# Altium schematic sheet payload_esp32.SchDoc (part 3 of 4)
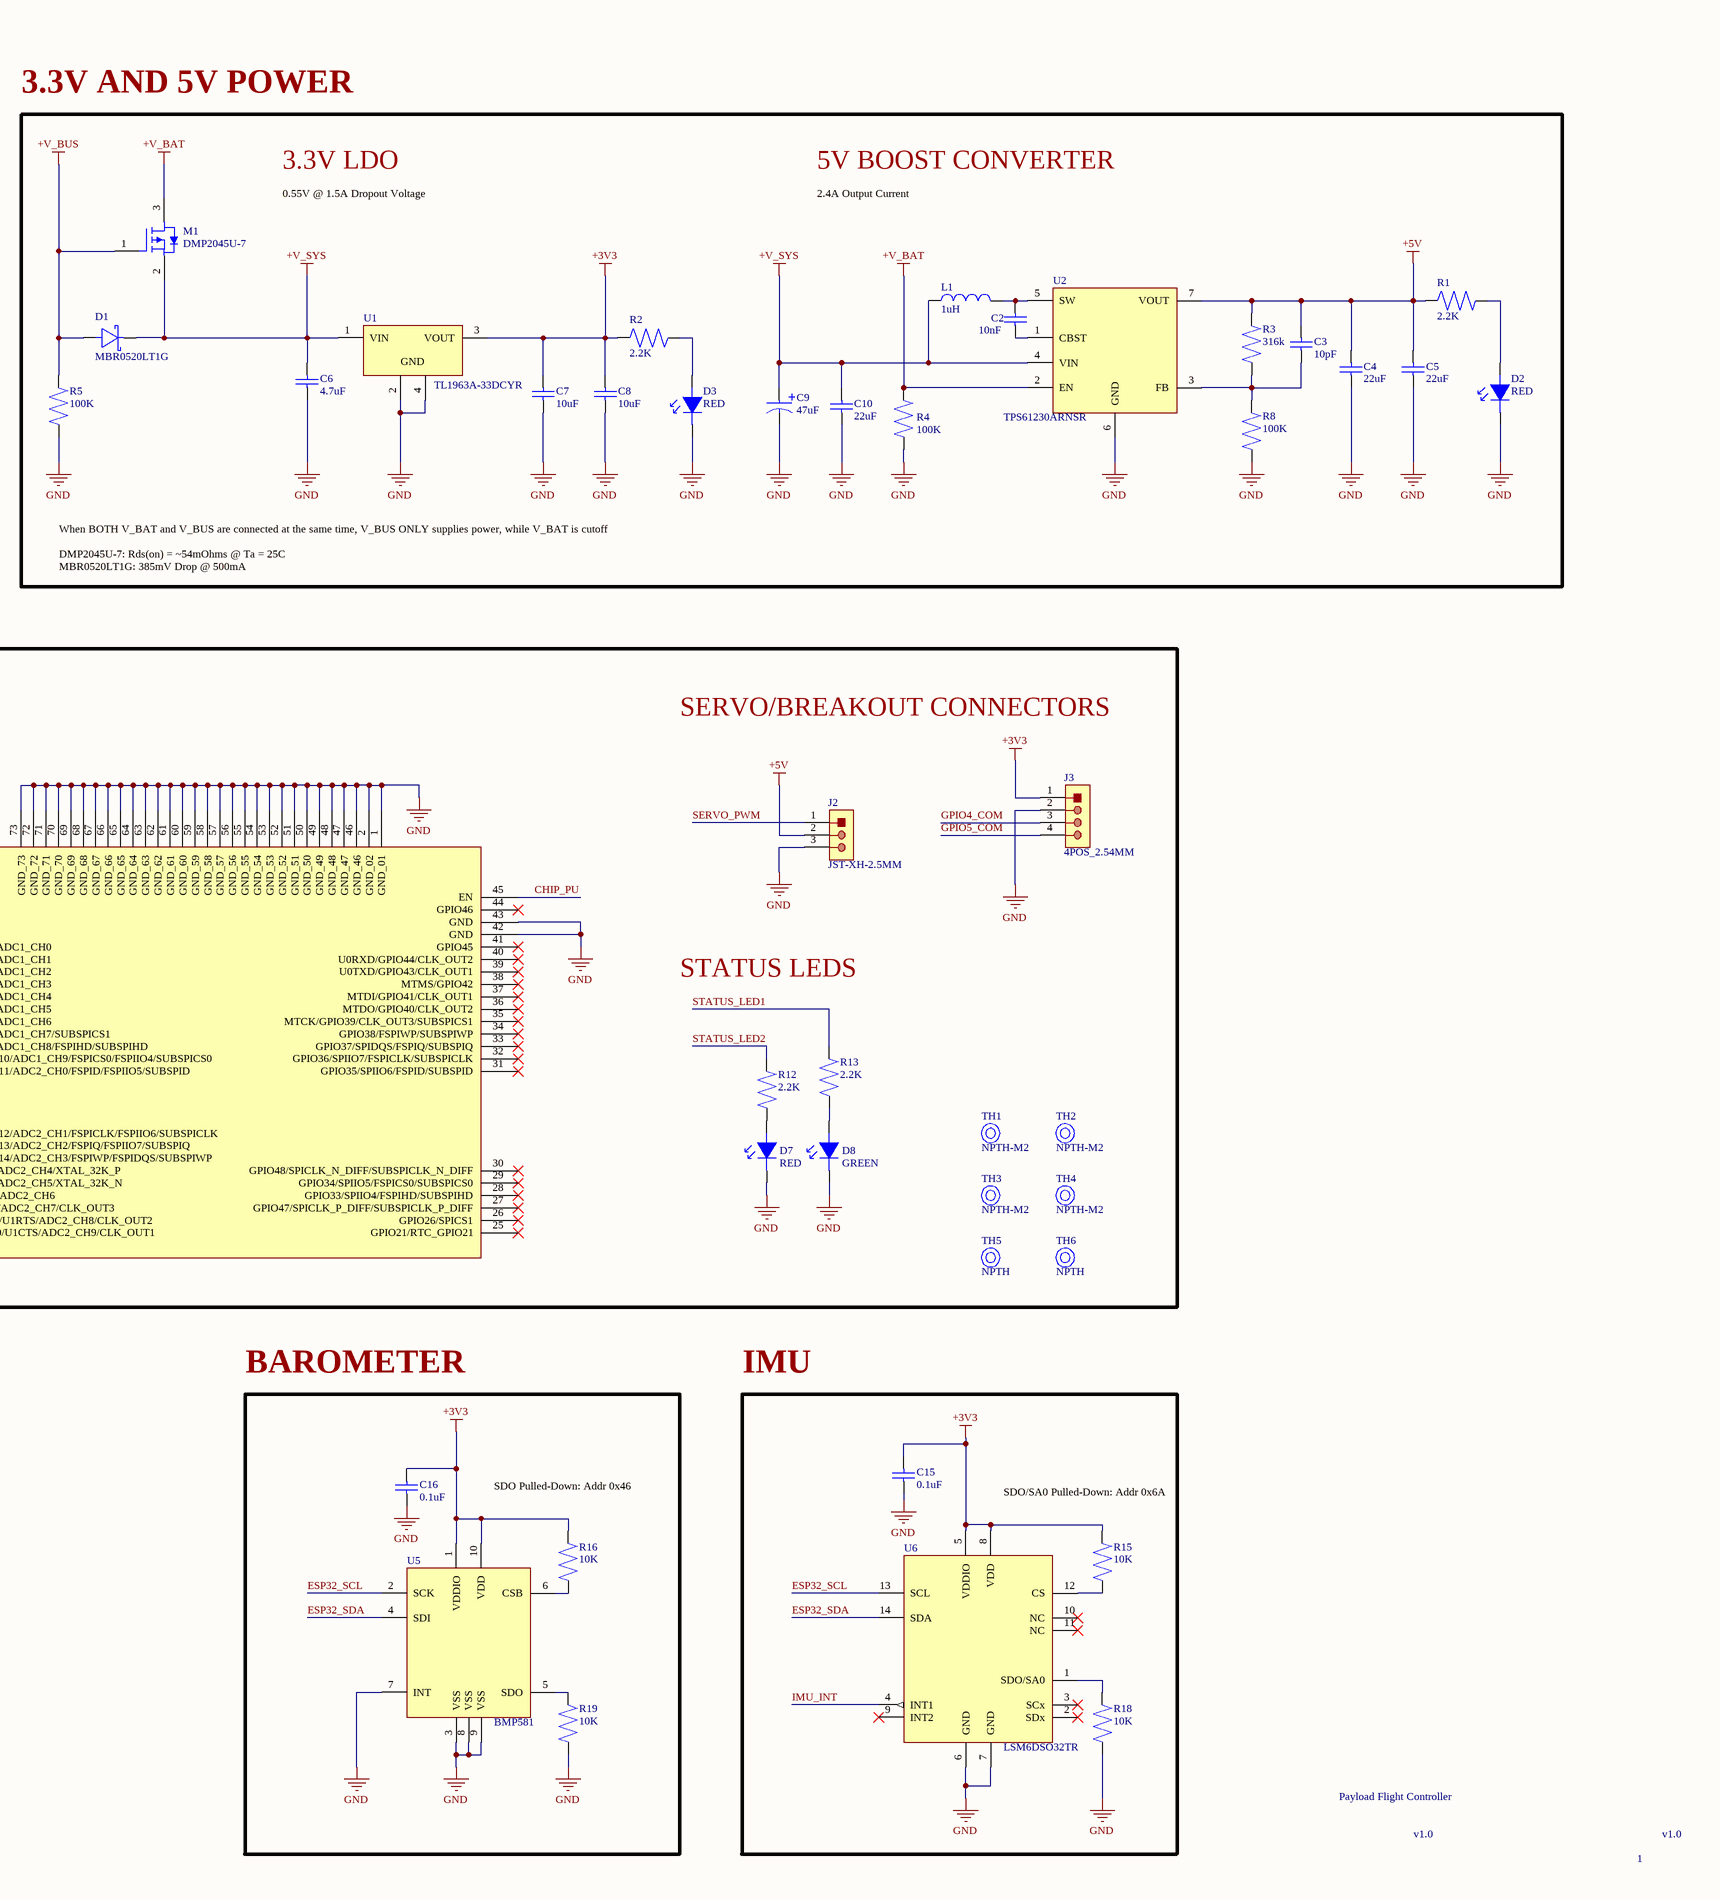
[diagram p3: payload_esp32.SchDoc, right]

## Library data of the parts (continued)
D2 D3 D7 = VLMS1500-GS08: LED RED 0402 SMD; Manufacturer: Vishay; Shape: Rectangular; Forward Current: 30mA; Forward Voltage: 2.4V; Luminous Intensity-Nom: 54mcd; Channels: 1; Optoelectronic Device Type: SINGLE COLOR LED; Reverse Voltage-Max: 5V; Viewing Angle: 130°; Overall Height: 0.35mm; Supplier: Digikey; Supplier Part Number: VLMS1500-GS08CT-ND; Manufacturer Part Number: VLMS1500-GS08; RoHS: Yes; Category: LEDs; Stock: 76559; Pricing: 1=0.24, 10=0.164, 100=0.1147, 500=0.09218, 1000=0.0847 (USD); Mounting Technology: Surface Mount; Pins: 2; Color: Red; Color@wavelength: Red; Min Operating Temperature: -30°C; Max Operating Temperature: 85°C; Packaging: Tape and Reel; Size: 0.5mm; Terminal Pitch: 0.95mm; Reach SVHC Compliant: Yes; RoHS Compliant: Yes; ComponentLink1URL: https://datasheet.ciiva.com:443/pdfs/VipMasterIC/IC/VISH/VISH-S-A0003457490/VISH-S-A0003457490-1.pdf?src-supplier=IHS+Markit; ComponentLink1Description: https://datasheet.ciiva.com:443/pdfs/VipMasterIC/IC/VISH/VISH-S-A0003457490/VISH-S-A0003457490-1.pdf?src-supplier=IHS+Markit; ComponentLink2URL: https://datasheet.ciiva.com/13945/vlmo1500-13945367.pdf?src-supplier=Digikey; ComponentLink2Description: https://datasheet.ciiva.com/13945/vlmo1500-13945367.pdf?src-supplier=Digikey; ComponentLink3URL: https://datasheet.ciiva.com/13945/vlmo1500-13945368.pdf?src-supplier=Digikey; ComponentLink3Description: https://datasheet.ciiva.com/13945/vlmo1500-13945368.pdf?src-supplier=Digikey; ComponentLink4URL: https://datasheet.ciiva.com/13945/vlmo1500-13945369.pdf?src-supplier=Digikey; ComponentLink4Description: https://datasheet.ciiva.com/13945/vlmo1500-13945369.pdf?src-supplier=Digikey
D4-D6 D9 = AQ3045-01ETG: TVS DIODE 5.3VWM 12VC SOD882; Manufacturer: Littelfuse; Diode Element Material: SILICON; Package Body Material: Plastic; Polarity: Bidirectional; Max Breakdown Voltage: 9V; Min Breakdown Voltage: 6.8V; Diode Type: TRANS VOLTAGE SUPPRESSOR; Non-rep Peak Rev Power Dis-Max: 40W; Number of Elements: 1; Rep Pk Reverse Voltage-Max: 5.3V; Reference Standard: AEC-Q101; Supplier: Digikey; Supplier Part Number: F9321CT-ND; Manufacturer Part Number: AQ3045-01ETG; RoHS: Yes; Category: TVS Diodes; Stock: 127; Pricing: 1=0.46, 10=0.302, 100=0.141, 500=0.134, 1000=0.127, 2000=0.1255, 5000=0.124 (USD); Pins: 2; Package Shape: Rectangular; Min Operating Temperature: -55°C; Max Operating Temperature: 150°C; Package Style: CHIP CARRIERMeter; Surface Mount: Yes; Technology: AVALANCHE; Terminal Form: No Lead; Terminal Position: BOTTOM; Reach SVHC Compliant: Yes; RoHS Compliant: Yes; ComponentLink1URL: https://datasheet.ciiva.com:443/pdfs/VipMasterIC/IC/LFSI/LFSI-S-A0007892042/LFSI-S-A0007892042-1.pdf?src-supplier=IHS+Markit; ComponentLink1Description: https://datasheet.ciiva.com:443/pdfs/VipMasterIC/IC/LFSI/LFSI-S-A0007892042/LFSI-S-A0007892042-1.pdf?src-supplier=IHS+Markit; ComponentLink2URL: http://www.littelfuse.com/~/media/electronics/datasheets/tvs_diode_arrays/littelfuse_tvs_diode_array_aq3045_datasheet.pdf.pdf?src-supplier=Digikey; ComponentLink2Description: http://www.littelfuse.com/~/media/electronics/datasheets/tvs_diode_arrays/littelfuse_tvs_diode_array_aq3045_datasheet.pdf.pdf?src-supplier=Digikey; ComponentLink3URL: https://www.littelfuse.com/~/media/electronics/datasheets/tvs_diode_arrays/littelfuse_tvs_diode_array_aq3045_datasheet.pdf.pdf?src-supplier=Digikey; ComponentLink3Description: https://www.littelfuse.com/~/media/electronics/datasheets/tvs_diode_arrays/littelfuse_tvs_diode_array_aq3045_datasheet.pdf.pdf?src-supplier=Digikey; ComponentLink4URL: https://datasheet.octopart.com/AQ3045-01ETG-Littelfuse-datasheet-101609968.pdf?src-supplier=Farnell; ComponentLink4Description: https://datasheet.octopart.com/AQ3045-01ETG-Littelfuse-datasheet-101609968.pdf?src-supplier=Farnell; ComponentLink5URL: https://datasheet.octopart.com/AQ3045-01ETG-Littelfuse-datasheet-140480283.pdf?src-supplier=Future+Electronics; ComponentLink5Description: https://datasheet.octopart.com/AQ3045-01ETG-Littelfuse-datasheet-140480283.pdf?src-supplier=Future+Electronics
D8 = VLMG1500-GS08: LED YLW-GRN 0402 SMD; Manufacturer: Vishay; Color: Green,Yellow; Shape: Rectangular; Forward Current: 30mA; Forward Voltage: 2.4V; Luminous Intensity-Nom: 90mcd; Channels: 1; Optoelectronic Device Type: SINGLE COLOR LED; Reverse Voltage-Max: 5V; Viewing Angle: 130°; Overall Height: 0.35mm; Supplier: Digikey; Supplier Part Number: VLMG1500-GS08CT-ND; Manufacturer Part Number: VLMG1500-GS08; RoHS: Yes; Category: LEDs; Stock: 41344; Pricing: 1=0.24, 10=0.164, 100=0.1147, 500=0.09218, 1000=0.0847 (USD); Mounting Technology: Surface Mount; Pins: 2; Color@wavelength: Green; Min Operating Temperature: -30°C; Max Operating Temperature: 85°C; Packaging: Tape and Reel; Size: 0.5mm; Terminal Pitch: 0.95mm; Reach SVHC Compliant: Yes; RoHS Compliant: Yes; ComponentLink1URL: https://datasheet.ciiva.com:443/pdfs/VipMasterIC/IC/VISH/VISH-S-A0003457490/VISH-S-A0003457490-1.pdf?src-supplier=IHS+Markit; ComponentLink1Description: https://datasheet.ciiva.com:443/pdfs/VipMasterIC/IC/VISH/VISH-S-A0003457490/VISH-S-A0003457490-1.pdf?src-supplier=IHS+Markit; ComponentLink2URL: https://datasheet.ciiva.com/12071/vlmo1500-244705-12071911.pdf?src-supplier=Mouser; ComponentLink2Description: https://datasheet.ciiva.com/12071/vlmo1500-244705-12071911.pdf?src-supplier=Mouser; ComponentLink3URL: https://datasheet.ciiva.com/13945/vlmo1500-13945360.pdf?src-supplier=Digikey; ComponentLink3Description: https://datasheet.ciiva.com/13945/vlmo1500-13945360.pdf?src-supplier=Digikey; ComponentLink4URL: https://datasheet.ciiva.com/30005/vlmo1500-30005134.pdf?src-supplier=Avnet; ComponentLink4Description: https://datasheet.ciiva.com/30005/vlmo1500-30005134.pdf?src-supplier=Avnet; ComponentLink5URL: https://datasheet.ciiva.com/13945/vlmo1500-13945358.pdf?src-supplier=Digikey; ComponentLink5Description: https://datasheet.ciiva.com/13945/vlmo1500-13945358.pdf?src-supplier=Digikey; ComponentLink6URL: https://datasheet.ciiva.com/13945/vlmo1500-13945359.pdf?src-supplier=Digikey; ComponentLink6Description: https://datasheet.ciiva.com/13945/vlmo1500-13945359.pdf?src-supplier=Digikey
J1 = 217179-0001: CONN RCP USB2.0 TYP C 24P SMD RA; Manufacturer: Molex; Supplier: Digikey; Supplier Part Number: 900-2171790001CT-ND; Manufacturer Part Number: 217179-0001; RoHS: No; Category: Connectors; Stock: 13210; Pricing: 1=0.79, 10=0.645, 25=0.5948, 50=0.5594, 100=0.5259, 250=0.48484, 500=0.45592 (USD)
J2 = S3B-XH-A(LF)(SN): CONN JST-XH 3 POS 2.5mm Solder RA Side Entry Thru-Hole Box; Manufacturer: JST; Connector Type: Male Pin; Contact Resistance: 20mΩ; Current Rating: 3A; Frequency: 1.8MHz; Gender: Male; Insulation Resistance: 1GΩ; Max Output current: -10mA; Max Supply Voltage: 15V; Max Voltage Rating (AC): 250V; Min Supply Voltage: 1V; Nominal Supply Current: 170µA; Number of Contacts: 3; Wire/Cable Gauge: 22AWG; Supplier: Mouser; Supplier Part Number: 306-S3B-XH-ALFSN; Manufacturer Part Number: S3B-XH-A(LF)(SN); RoHS: Compliant; Category: Headers and Wire Housings; Stock: 25036; Pricing: 1=0.15, 10=0.126, 50=0.126, 100=0.107, 1000=0.09, 10000=0.077 (USD); Case/Package: DIP; China RoHS: Compliant; Color: Natural; Contact Gender: Male; Contact Material: Brass; Contact Plating: Tin; Depth: 11.5mm; Export Control Classification Number (ECCN) Code: EAR99; Height: 4.57mm; Housing Color: White; Housing Material: Polyamide; Harmonized Tariff Schedule (HTS) Code: 8536.69.40.40; Introduction Date: 2010-11-30; Lead Free: Lead Free; Lead Pitch: 2.5mm; Length: 9.81mm; Lifecycle Status: Production; Max Current Rating: 3A; Max Operating Temperature: 85°C; Min Operating Temperature: -25°C; Mounting Technology: Through Hole; Pins: 3; Number of Poles: 3; Number of Positions: 3; Number of Rows: 1; Orientation: Right Angle; Packaging: Rail/Tube; Pitch: 2.5mm; Radiation Hardening: No; REACH SVHC: Yes; Terminal Pitch: 2.5mm; Termination: Press-Fit; Voltage Rating: 250V; Voltage Rating (AC): 250V; Weight: 440.409842mg; Width: 6.35mm; ComponentLink1URL: https://datasheet.octopart.com:443/S3B-XH-A%28LF%29%28SN%29-JST-datasheet-12510042.pdf?src-supplier=Upverter; ComponentLink1Description: https://datasheet.octopart.com:443/S3B-XH-A%28LF%29%28SN%29-JST-datasheet-12510042.pdf?src-supplier=Upverter; ComponentLink2URL: https://datasheet.octopart.com:443/S3B-XH-A%28LF%29%28SN%29-JST-datasheet-8325564.pdf?src-supplier=Burklin+Elektronik; ComponentLink2Description: https://datasheet.octopart.com:443/S3B-XH-A%28LF%29%28SN%29-JST-datasheet-8325564.pdf?src-supplier=Burklin+Elektronik; ComponentLink3URL: https://datasheet.octopart.com:443/S3B-XH-A%28LF%29%28SN%29-JST-datasheet-138896056.pdf?src-supplier=IHS; ComponentLink3Description: https://datasheet.octopart.com:443/S3B-XH-A%28LF%29%28SN%29-JST-datasheet-138896056.pdf?src-supplier=IHS; ComponentLink4URL: https://datasheet.octopart.com:443/S3B-XH-A-%28LF%29%28SN%29-JST-datasheet-62336360.pdf?src-supplier=element14+APAC; ComponentLink4Description: https://datasheet.octopart.com:443/S3B-XH-A-%28LF%29%28SN%29-JST-datasheet-62336360.pdf?src-supplier=element14+APAC; ComponentLink5URL: https://datasheet.octopart.com:443/S3B-XH-A-%28LF%29%28SN%29-JST-datasheet-63094.pdf?src-supplier=element14+APAC; ComponentLink5Description: https://datasheet.octopart.com:443/S3B-XH-A-%28LF%29%28SN%29-JST-datasheet-63094.pdf?src-supplier=element14+APAC; ComponentLink6URL: https://datasheet.octopart.com:443/S3B-XH-A%28LF%29%28SN%29-JST-datasheet-140264791.pdf?src-supplier=LKR; ComponentLink6Description: https://datasheet.octopart.com:443/S3B-XH-A%28LF%29%28SN%29-JST-datasheet-140264791.pdf?src-supplier=LKR; ComponentLink7URL: https://datasheet.octopart.com:443/S3B-XH-A%28LF%29%28SN%29-JST-datasheet-8328076.pdf?src-supplier=Future+Electronics; ComponentLink7Description: https://datasheet.octopart.com:443/S3B-XH-A%28LF%29%28SN%29-JST-datasheet-8328076.pdf?src-supplier=Future+Electronics
J3 = 61300411121: CONN HEADER VERT 4POS 2.54MM; Manufacturer: Wurth Elektronik; Manufacturer Lifecycle Status: ACTIVE; Connector Type: Male Pin; Contact Resistance: 20mΩ; Current Rating: 3A; Gender: Male; Insulation Resistance: 1GΩ; Number of Contacts: 4; Operating Supply Voltage: 250V; YEOL: 1 = Estimated lifetime > 10 years; Supplier: DigiKey; Supplier Part Number: 732-5317-ND; Manufacturer Part Number: 61300411121; RoHS: Compliant; Category: Headers and Wire Housings; Stock: 35219; Pricing: 1=0.19, 10=0.163, 25=0.1352, 50=0.113, 100=0.102, 1000=0.0986 (USD); Color: Black; Contact Material: Gold; Contact Mating Length: 5.9944mm; Contact Plating: Gold; Height: 8.89mm; Lead Free: Lead Free; Lead Pitch: 2.54mm; Length: 10.16mm; Lifecycle Status: Production; Max Operating Temperature: 105°C; Min Operating Temperature: -40°C; Mounting Technology: Through Hole; Pins: 4; Number of Positions: 4; Number of Rows: 1; Orientation: Vertical; Packaging: Bulk; Pitch: 2.54mm; Termination: Solder; Voltage Rating: 250V; ComponentLink1URL: https://datasheet.octopart.com:443/61300411121-W%C3%BCrth-Elektronik-datasheet-44382959.pdf?src-supplier=Future+Electronics; ComponentLink1Description: https://datasheet.octopart.com:443/61300411121-W%C3%BCrth-Elektronik-datasheet-44382959.pdf?src-supplier=Future+Electronics; ComponentLink2URL: https://datasheet.octopart.com:443/61300411121-Wurth-Elektronik-datasheet-169474491.pdf?src-supplier=Wurth+Elektronik; ComponentLink2Description: https://datasheet.octopart.com:443/61300411121-Wurth-Elektronik-datasheet-169474491.pdf?src-supplier=Wurth+Elektronik; ComponentLink3URL: https://datasheet.octopart.com:443/61300411121-W%C3%BCrth-Elektronik-datasheet-149524049.pdf?src-supplier=Farnell; ComponentLink3Description: https://datasheet.octopart.com:443/61300411121-W%C3%BCrth-Elektronik-datasheet-149524049.pdf?src-supplier=Farnell; ComponentLink4URL: https://datasheet.octopart.com:443/61300411121-W%C3%BCrth-Elektronik-datasheet-21154836.pdf?src-supplier=element14+APAC; ComponentLink4Description: https://datasheet.octopart.com:443/61300411121-W%C3%BCrth-Elektronik-datasheet-21154836.pdf?src-supplier=element14+APAC
J4 = S2B-PH-K-S(LF)(SN): CONN HEADER R/A 2POS 2MM; Manufacturer: JST; Value: 10µF; Connector Type: Male Pin; Contact Resistance: 20mΩ; Current Rating: 2A; Gender: Male; Insulation Resistance: 1GΩ; Max Voltage Rating (AC): 100V; Number of Contacts: 2; Tolerance: 20%; Voltage Rating: 50V; Supplier: Mouser; Supplier Part Number: 306-S2BPHKSLFSNPP; Manufacturer Part Number: S2B-PH-K-S(LF)(SN); RoHS: Compliant; Category: Headers and Wire Housings; Pricing: 1=0.1, 10=0.082, 50=0.082, 100=0.07, 250=0.063, 1000=0.059, 5000=0.052, 10000=0.05 (USD); Case/Package: Radial; China RoHS: Compliant; Color: Natural, White; Contact Gender: Male; Contact Material: Brass; Contact Mating Length: 3.302mm; Contact Plating: Tin; Country of Origin: Malaysia; Depth: 7.6mm; Diameter: 5mm; Export Control Classification Number (ECCN) Code: EAR99; Fastening Type: Detent; Flammability Rating: UL94 V-0; Height: 11mm; Harmonized Tariff Schedule (HTS) Code: 8536.69.40.40; Introduction Date: 2003-05-06; Lead Free: Lead Free; Lead Pitch: 2mm; Length: 11mm; Lifecycle Status: Production; Max Current Rating: 2A; Max Operating Temperature: 85°C; Max Voltage Rating (DC): 100V; Min Operating Temperature: -25°C; Mounting Technology: Through Hole; Pins: 2; Number of Poles: 2; Number of Positions: 2; Number of Rows: 1; Orientation: Right Angle; Packaging: Bulk; Pitch: 2mm; Radiation Hardening: No; REACH SVHC: Yes; Terminal Pitch: 2mm; Termination: Solder; Voltage Rating (AC): 100V; Voltage Rating (DC): 50V; Weight: 28.349523g; Width: 4.5mm; Working Voltage: 100V; ComponentLink1URL: https://datasheet.octopart.com:443/S2B-PH-K-S%28LF%29%28SN%29-JST-datasheet-180491669.pdf?src-supplier=IHS; ComponentLink1Description: https://datasheet.octopart.com:443/S2B-PH-K-S%28LF%29%28SN%29-JST-datasheet-180491669.pdf?src-supplier=IHS; ComponentLink2URL: https://datasheet.octopart.com:443/S2B-PH-K-S%28LF%29%28SN%29-JST-datasheet-10411123.pdf?src-supplier=Upverter; ComponentLink2Description: https://datasheet.octopart.com:443/S2B-PH-K-S%28LF%29%28SN%29-JST-datasheet-10411123.pdf?src-supplier=Upverter; ComponentLink3URL: https://datasheet.octopart.com:443/S2B-PH-K-S%28LF%29%28SN%29-JST-datasheet-8324864.pdf?src-supplier=Upverter; ComponentLink3Description: https://datasheet.octopart.com:443/S2B-PH-K-S%28LF%29%28SN%29-JST-datasheet-8324864.pdf?src-supplier=Upverter; ComponentLink4URL: https://datasheet.octopart.com:443/S2B-PH-K-S%28LF%29%28SN%29-JST-datasheet-56537.pdf?src-supplier=Upverter; ComponentLink4Description: https://datasheet.octopart.com:443/S2B-PH-K-S%28LF%29%28SN%29-JST-datasheet-56537.pdf?src-supplier=Upverter; ComponentLink5URL: https://datasheet.octopart.com:443/S2B-PH-K-S%28LF%29%28SN%29-JST-datasheet-15068535.pdf?src-supplier=Upverter; ComponentLink5Description: https://datasheet.octopart.com:443/S2B-PH-K-S%28LF%29%28SN%29-JST-datasheet-15068535.pdf?src-supplier=Upverter; ComponentLink6URL: https://datasheet.octopart.com:443/S2B-PH-K-S%28LF%29%28SN%29-JST-datasheet-147762421.pdf?src-supplier=LKR; ComponentLink6Description: https://datasheet.octopart.com:443/S2B-PH-K-S%28LF%29%28SN%29-JST-datasheet-147762421.pdf?src-supplier=LKR; ComponentLink7URL: https://datasheet.octopart.com:443/S2B-PH-K-S%28LF%29%28SN%29-JST-datasheet-12510261.pdf?src-supplier=Future+Electronics; ComponentLink7Description: https://datasheet.octopart.com:443/S2B-PH-K-S%28LF%29%28SN%29-JST-datasheet-12510261.pdf?src-supplier=Future+Electronics
L1 = XFL4020-102MEC: IND 1UH 11A 11.9 MOHM SMD; Manufacturer: Coilcraft; Core Material: Composite; DC Resistance (DCR): 11.9mΩ; Value: 1µH; Inductance Tolerance: 20%; Number of Circuits: 1; Saturation Current: 4.5A; Self Resonant Frequency: 64MHz; Shielding: Shielded; Test Frequency: 1MHz; Supplier: Mouser; Supplier Part Number: 994-XFL4020-102MEC; Manufacturer Part Number: XFL4020-102MEC; RoHS: Compliant; Category: Fixed Inductors; Stock: 3102; Pricing: 1=3.13, 10=2.67, 25=2.46, 50=2.46, 100=1.83, 250=1.78, 500=1.37, 1000=1.37, 10000=1.37 (USD); Ambient Temperature Range High: 125°C; Case/Package: 1616; Height: 2.1mm; Lead Free: Contains Lead; Length: 4mm; Lifecycle Status: Production; Max Current Rating: 11A; Max DC Current: 11A; Max Operating Temperature: 125°C; Min Operating Temperature: -40°C; Mounting Technology: Surface Mount; Number of Terminals: 2; Packaging: Cut Tape; REACH SVHC: Yes; RMS Current (Irms): 11A; ESR: 11.9mΩ; Termination: SMD/SMT; Tolerance: 20%; Width: 4mm; ComponentLink1URL: https://datasheet.octopart.com:443/XFL4020-102MEC-Coilcraft-datasheet-180122279.pdf?src-supplier=Newark; ComponentLink1Description: https://datasheet.octopart.com:443/XFL4020-102MEC-Coilcraft-datasheet-180122279.pdf?src-supplier=Newark; ComponentLink2URL: https://datasheet.octopart.com:443/XFL4020-102MEC-Coilcraft-datasheet-14354401.pdf?src-supplier=Newark; ComponentLink2Description: https://datasheet.octopart.com:443/XFL4020-102MEC-Coilcraft-datasheet-14354401.pdf?src-supplier=Newark; ComponentLink3URL: https://datasheet.octopart.com:443/XFL4020-102MEC-Coilcraft-datasheet-10792328.pdf?src-supplier=Coilcraft+Direct; ComponentLink3Description: https://datasheet.octopart.com:443/XFL4020-102MEC-Coilcraft-datasheet-10792328.pdf?src-supplier=Coilcraft+Direct
M1 = DMP2045U-7: MOSFET P-CH 20V 4.3A SOT23; Manufacturer: Diodes Inc.; Drain to Source Resistance: 45mΩ; Max Power Dissipation: 1.2W; Number of Elements: 1; Supplier: DigiKey; Supplier Part Number: DMP2045U-7DICT-ND; Manufacturer Part Number: DMP2045U-7; RoHS: Compliant; Category: MOSFETs; Stock: 29966; Pricing: 1=0.38, 10=0.236, 100=0.1483, 500=0.11024, 1000=0.09795 (USD); China RoHS: Compliant; Continuous Drain Current (ID): 4.3A; Country of Origin: Mainland China; Export Control Classification Number (ECCN) Code: EAR99; Introduction Date: 2018-02-08; Lifecycle Status: Production; Max Operating Temperature: 150°C; Min Breakdown Voltage: 20V; Min Operating Temperature: -55°C; Number of Terminals: 3; REACH SVHC: Yes; Schedule B: 8541290080, 8541290080|8541290080|8541290080|8541290080|8541290080; ComponentLink1URL: https://datasheet.octopart.com:443/DMP2045U-7-Diodes-Inc.-datasheet-180553531.pdf?src-supplier=IHS; ComponentLink1Description: https://datasheet.octopart.com:443/DMP2045U-7-Diodes-Inc.-datasheet-180553531.pdf?src-supplier=IHS; ComponentLink2URL: https://datasheet.octopart.com:443/DMP2045U-7-Diodes-Inc.-datasheet-140438452.pdf?src-supplier=Newark; ComponentLink2Description: https://datasheet.octopart.com:443/DMP2045U-7-Diodes-Inc.-datasheet-140438452.pdf?src-supplier=Newark; ComponentLink3URL: https://datasheet.octopart.com:443/DMP2045U-7-Diodes-Inc.-datasheet-118179393.pdf?src-supplier=Diodes+Inc+SCT; ComponentLink3Description: https://datasheet.octopart.com:443/DMP2045U-7-Diodes-Inc.-datasheet-118179393.pdf?src-supplier=Diodes+Inc+SCT; ComponentLink4URL: https://sigma.octopart.com:443/138706058/technical_drawing/Diodes-Inc.-DMP2045U-7.pdf?src-supplier=Diodes+Inc+SCT; ComponentLink4Description: https://sigma.octopart.com:443/138706058/technical_drawing/Diodes-Inc.-DMP2045U-7.pdf?src-supplier=Diodes+Inc+SCT; ComponentLink5URL: https://datasheet.octopart.com:443/DMP2045U-7-Diodes-Inc.-datasheet-175575476.pdf?src-supplier=SOS+electronic; ComponentLink5Description: https://datasheet.octopart.com:443/DMP2045U-7-Diodes-Inc.-datasheet-175575476.pdf?src-supplier=SOS+electronic; ComponentLink6URL: https://datasheet.octopart.com:443/DMP2045U-7-Diodes-Inc.-datasheet-129878686.pdf?src-supplier=TME; ComponentLink6Description: https://datasheet.octopart.com:443/DMP2045U-7-Diodes-Inc.-datasheet-129878686.pdf?src-supplier=TME
M2 M3 = CSD16327Q3: MOSFET N-CH 25V 60A 8VSON; Manufacturer: Texas Instruments; Manufacturer Lifecycle Status: ACTIVE; Continuous Drain Current (ID): 22A; Drain to Source Resistance: 3.4mΩ; Element Configuration: Single; Fall Time: 6.3ns; Gate to Source Voltage (Vgs): 10V; Input Capacitance: 1.3nF; Max Junction Temperature (Tj): 150°C; Max Power Dissipation: 3W; Number of Channels: 1; Power Dissipation: 2.8W; Rds On Max: 4mΩ; Rise Time: 15ns; Threshold Voltage: 1.2V; Turn-Off Delay Time: 13ns; Turn-On Delay Time: 5.3ns; Supplier: DigiKey; Supplier Part Number: 296-30138-1-ND; Manufacturer Part Number: CSD16327Q3; RoHS: Compliant; Category: MOSFETs; Stock: 3480; Pricing: 1=1.66, 10=1.053, 100=0.7044, 500=0.55478, 1000=0.50665 (USD); Contact Plating: Tin; Drain to Source Breakdown Voltage: 25V; Drain to Source Voltage (Vdss): 25V; Height: 1.1mm; Lead Free: Contains Lead; Length: 3.3mm; Lifecycle Status: Production; Max Operating Temperature: 150°C; Min Operating Temperature: -55°C; Mounting Technology: Surface Mount; Number of Elements: 1; Pins: 8; Packaging: Tape & Reel (TR); REACH SVHC: Unknown; Schedule B: 8541290080, 8541290080|8541290080|8541290080|8541290080|8541290080; Thickness: 1mm; Width: 3.3mm; ComponentLink1URL: https://datasheet.octopart.com:443/CSD16327Q3-Texas-Instruments-datasheet-41215218.pdf?src-supplier=Newark; ComponentLink1Description: https://datasheet.octopart.com:443/CSD16327Q3-Texas-Instruments-datasheet-41215218.pdf?src-supplier=Newark; ComponentLink2URL: https://datasheet.octopart.com:443/CSD16327Q3-Texas-Instruments-datasheet-62333605.pdf?src-supplier=Newark; ComponentLink2Description: https://datasheet.octopart.com:443/CSD16327Q3-Texas-Instruments-datasheet-62333605.pdf?src-supplier=Newark; ComponentLink3URL: https://octopart.com:443/opatz8j6/c1?t=Z2pwwjp5r0bE5btE9l64bXmPWfQRGETB383KX8E-OXvi6wIUplzmoNw8yWrwO6Q-65cgyRoN8tgwAzBck62Huj1PMkuLhp362LQ8SjUqtMUWeIXEeRmYTu_k-SYMO6O26nR1HA3X9Q0RPxYGoErxWR1lJ9jTbTijB9eaBAFwssK0FaQdnGeoQHPydjrC8lbUyYGCBulaYRci_DLfLJ-TfZ7gfGK1BSTk_7vadWilql3U8XNZ9g2CN9iu2Zdm64er9u-P3ylYxn4g-BWi71sIpPvQ1B1sdf5k-_vIcZWxKiSghNnANWjnXskOLhcuU5h9dJuxZd22UjxRrNMY3ps_eh2rJVVc3_NVhb2xrToe294uoDN2eAsqeRCox9oo47WixB5w1hSj7LY&src-supplier=Texas+Instruments; ComponentLink3Description: https://octopart.com:443/opatz8j6/c1?t=Z2pwwjp5r0bE5btE9l64bXmPWfQRGETB383KX8E-OXvi6wIUplzmoNw8yWrwO6Q-65cgyRoN8tgwAzBck62Huj1PMkuLhp362LQ8SjUqtMUWeIXEeRmYTu_k-SYMO6O26nR1HA3X9Q0RPxYGoErxWR1lJ9jTbTijB9eaBAFwssK0FaQdnGeoQHPydjrC8lbUyYGCBulaYRci_DLfLJ-TfZ7gfGK1BSTk_7vadWilql3U8XNZ9g2CN9iu2Zdm64er9u-P3ylYxn4g-BWi71sIpPvQ1B1sdf5k-_vIcZWxKiSghNnANWjnXskOLhcuU5h9dJuxZd22UjxRrNMY3ps_eh2rJVVc3_NVhb2xrToe294uoDN2eAsqeRCox9oo47WixB5w1hSj7LY&src-supplier=Texas+Instruments; ComponentLink4URL: https://datasheet.octopart.com:443/CSD16327Q3-Texas-Instruments-datasheet-10669698.pdf?src-supplier=Texas+Instruments; ComponentLink4Description: https://datasheet.octopart.com:443/CSD16327Q3-Texas-Instruments-datasheet-10669698.pdf?src-supplier=Texas+Instruments; ComponentLink5URL: https://datasheet.octopart.com:443/CSD16327Q3-Texas-Instruments-datasheet-164413762.pdf?src-supplier=Augswan; ComponentLink5Description: https://datasheet.octopart.com:443/CSD16327Q3-Texas-Instruments-datasheet-164413762.pdf?src-supplier=Augswan; ComponentLink6URL: http://sigma.octopart.com:80/reach_statement/Texas-Instruments-company-64.pdf?src-supplier=Compliance+Statements; ComponentLink6Description: http://sigma.octopart.com:80/reach_statement/Texas-Instruments-company-64.pdf?src-supplier=Compliance+Statements; ComponentLink7URL: http://sigma.octopart.com:80/conflict_mineral_statement/Texas-Instruments-company-63.pdf?src-supplier=Compliance+Statements; ComponentLink7Description: http://sigma.octopart.com:80/conflict_mineral_statement/Texas-Instruments-company-63.pdf?src-supplier=Compliance+Statements
R1 R2 R12 R13 R17 = RC0402FR-072K2L: RES 2.2K OHM 1% 1/16W 0402; Manufacturer: Yageo Group; Power Dissipation: 62.5mW; Power Rating: 63mW; Value: 2.2kΩ; Temperature Coefficient: 100ppm/°C; Voltage Rating: 50V; Supplier: DigiKey; Supplier Part Number: 311-2.20KLRCT-ND; Manufacturer Part Number: RC0402FR-072K2L; RoHS: Compliant; Category: Chip SMD Resistors; Stock: 524227; Pricing: 1=0.1, 10=0.007, 25=0.0056, 50=0.0048, 5000=0.00328, 10000=0.00127 (USD); Case/Package: 0402; Case Code (Imperial): 0402; China RoHS: Non-Compliant; Composition: Thick Film; Depth: 500µm; Height: 350µm; Lead Free: Lead Free; Length: 1mm; Lifecycle Status: Production; Max Operating Temperature: 155°C; Military Standard: Not; Min Operating Temperature: -55°C; Mounting Technology: Surface Mount; Pins: 2; Number of Terminals: 2; Packaging: Tape & Reel; REACH SVHC: Yes; Schedule B: 8533210045, 8533210045|8533210045|8533210045|8533210045|8533210045|8533210045|8533210045|8533210045|8533210045|8533210045|8533210045|8533210045|8533210045|8533210045, 8533210045|8533210045|8533210045|8533210045|8533210045|8533210045|8533210045|8533210045|8533210045|8533210045|8533210045|8533210045|8533210045|8533210045|8533210045, 8533210045|8533210045|8533210045|8533210045|8533210045|8533210045|8533210045|8533210045|8533210045|8533210045|8533210045|8533210045|8533210045|8533210045|8533210045|8533210045; Termination: SMD/SMT; Tolerance: 1%; Voltage Rating (AC): 50V; Voltage Rating (DC): 50V; Weight: 652.039032µg; Width: 500µm; Working Voltage: 50V; ComponentLink1URL: https://datasheet.octopart.com:443/RC0402FR-072K2L-Yageo-datasheet-175887523.pdf?src-supplier=IHS; ComponentLink1Description: https://datasheet.octopart.com:443/RC0402FR-072K2L-Yageo-datasheet-175887523.pdf?src-supplier=IHS; ComponentLink2URL: https://datasheet.octopart.com:443/RC0402FR-072K2L-Yageo-datasheet-103092701.pdf?src-supplier=Upverter; ComponentLink2Description: https://datasheet.octopart.com:443/RC0402FR-072K2L-Yageo-datasheet-103092701.pdf?src-supplier=Upverter; ComponentLink3URL: https://datasheet.octopart.com:443/RC0402FR-072K2L-Yageo-Group-datasheet-190305687.pdf?src-supplier=Future+Electronics; ComponentLink3Description: https://datasheet.octopart.com:443/RC0402FR-072K2L-Yageo-Group-datasheet-190305687.pdf?src-supplier=Future+Electronics; ComponentLink4URL: https://datasheet.octopart.com:443/RC0402FR-072K2L-Yageo-datasheet-164759695.pdf?src-supplier=Future+Electronics; ComponentLink4Description: https://datasheet.octopart.com:443/RC0402FR-072K2L-Yageo-datasheet-164759695.pdf?src-supplier=Future+Electronics; ComponentLink5URL: https://datasheet.octopart.com:443/RC0402FR-072K2L-Yageo-datasheet-137700087.pdf?src-supplier=Future+Electronics; ComponentLink5Description: https://datasheet.octopart.com:443/RC0402FR-072K2L-Yageo-datasheet-137700087.pdf?src-supplier=Future+Electronics; ComponentLink6URL: https://datasheet.octopart.com:443/RC0402FR-072K2L-Yageo-datasheet-12531192.pdf?src-supplier=Future+Electronics; ComponentLink6Description: https://datasheet.octopart.com:443/RC0402FR-072K2L-Yageo-datasheet-12531192.pdf?src-supplier=Future+Electronics; ComponentLink7URL: https://datasheet.octopart.com:443/RC0402FR-072K2L-Yageo-datasheet-8324255.pdf?src-supplier=Future+Electronics; ComponentLink7Description: https://datasheet.octopart.com:443/RC0402FR-072K2L-Yageo-datasheet-8324255.pdf?src-supplier=Future+Electronics; ComponentLink8URL: https://datasheet.octopart.com:443/RC0402FR-072K2L-Yageo-datasheet-10408619.pdf?src-supplier=element14+APAC; ComponentLink8Description: https://datasheet.octopart.com:443/RC0402FR-072K2L-Yageo-datasheet-10408619.pdf?src-supplier=element14+APAC; ComponentLink9URL: https://datasheet.octopart.com:443/RC0402FR-072K2L-Yageo-datasheet-8324527.pdf?src-supplier=Newark; ComponentLink9Description: https://datasheet.octopart.com:443/RC0402FR-072K2L-Yageo-datasheet-8324527.pdf?src-supplier=Newark; ComponentLink10URL: https://datasheet.octopart.com:443/RC0402FR-072K2L-Yageo-datasheet-62067350.pdf?src-supplier=Farnell; ComponentLink10Description: https://datasheet.octopart.com:443/RC0402FR-072K2L-Yageo-datasheet-62067350.pdf?src-supplier=Farnell; ComponentLink11URL: https://datasheet.octopart.com:443/RC0402FR-072K2L-Yageo-datasheet-8329306.pdf?src-supplier=element14; ComponentLink11Description: https://datasheet.octopart.com:443/RC0402FR-072K2L-Yageo-datasheet-8329306.pdf?src-supplier=element14; ComponentLink12URL: https://datasheet.octopart.com:443/RC0402FR-072K2L-Yageo-datasheet-175423674.pdf?src-supplier=SOS+electronic; ComponentLink12Description: https://datasheet.octopart.com:443/RC0402FR-072K2L-Yageo-datasheet-175423674.pdf?src-supplier=SOS+electronic; ComponentLink13URL: https://datasheet.octopart.com/RC0402FR-072K2L-Yageo-datasheet-73766026.pdf; ComponentLink13Description: https://datasheet.octopart.com/RC0402FR-072K2L-Yageo-datasheet-73766026.pdf; ComponentLink14URL: http://sigma.octopart.com:80/conflict_mineral_statement/Yageo-company-3.pdf?src-supplier=Compliance+Statements; ComponentLink14Description: http://sigma.octopart.com:80/conflict_mineral_statement/Yageo-company-3.pdf?src-supplier=Compliance+Statements; ComponentLink15URL: http://sigma.octopart.com:80/rohs_statement/Yageo-company-2.pdf?src-supplier=Compliance+Statements; ComponentLink15Description: http://sigma.octopart.com:80/rohs_statement/Yageo-company-2.pdf?src-supplier=Compliance+Statements
R3 = RC0603FR-07316KL: RES 316K OHM 1% 1/10W 0603; Manufacturer: Yageo Group; Max Power Dissipation: 100mW; Value: 316kΩ; Temperature Coefficient: 100ppm/°C; Voltage Rating: 75V; Voltage Rating (DC): 50V; Supplier: DigiKey; Supplier Part Number: 311-316KHRCT-ND; Manufacturer Part Number: RC0603FR-07316KL; RoHS: Compliant; Category: Chip SMD Resistors; Stock: 61355; Pricing: 1=0.1, 10=0.008, 25=0.0072, 50=0.0062, 100=0.0057 (USD); Case/Package: 0603; Case Code (Imperial): 0603; China RoHS: Non-Compliant; Composition: Thick Film; Depth: 800µm; Features: Moisture Resistant; Height: 450µm; Lead Free: Lead Free; Length: 1.6mm; Lifecycle Status: Production; Max Operating Temperature: 155°C; Military Standard: Not; Min Operating Temperature: -55°C; Mounting Technology: Surface Mount; Number of Terminals: 2; Number of Terminations: 2; Packaging: Tape & Reel; Power Dissipation: 100mW; Power Rating: 100mW; REACH SVHC: Yes; Schedule B: 8533210045, 8533210045|8533210045, 8533210045|8533210045|8533210045, 8533210045|8533210045|8533210045|8533210045; Termination: SMD/SMT; Tolerance: 1%; Width: 800µm; Working Voltage: 75V; ComponentLink1URL: https://datasheet.octopart.com:443/RC0603FR-07316KL-Yageo-datasheet-175887523.pdf?src-supplier=IHS; ComponentLink1Description: https://datasheet.octopart.com:443/RC0603FR-07316KL-Yageo-datasheet-175887523.pdf?src-supplier=IHS; ComponentLink2URL: https://datasheet.octopart.com:443/RC0603FR-07316KL-Yageo-datasheet-141265859.pdf?src-supplier=Upverter; ComponentLink2Description: https://datasheet.octopart.com:443/RC0603FR-07316KL-Yageo-datasheet-141265859.pdf?src-supplier=Upverter; ComponentLink3URL: https://datasheet.octopart.com:443/RC0603FR-07316KL-Yageo-datasheet-103092701.pdf?src-supplier=Upverter; ComponentLink3Description: https://datasheet.octopart.com:443/RC0603FR-07316KL-Yageo-datasheet-103092701.pdf?src-supplier=Upverter; ComponentLink4URL: https://sigma.octopart.com:443/138820526/technical_drawing/Yageo-RC0603FR-07316KL.pdf?src-supplier=Upverter; ComponentLink4Description: https://sigma.octopart.com:443/138820526/technical_drawing/Yageo-RC0603FR-07316KL.pdf?src-supplier=Upverter; ComponentLink5URL: https://datasheet.octopart.com:443/RC0603FR-07316KL-Yageo-Group-datasheet-189192902.pdf?src-supplier=TME; ComponentLink5Description: https://datasheet.octopart.com:443/RC0603FR-07316KL-Yageo-Group-datasheet-189192902.pdf?src-supplier=TME; ComponentLink6URL: https://datasheet.octopart.com:443/RC0603FR-07316KL-Yageo-Group-datasheet-176638170.pdf?src-supplier=Future+Electronics; ComponentLink6Description: https://datasheet.octopart.com:443/RC0603FR-07316KL-Yageo-Group-datasheet-176638170.pdf?src-supplier=Future+Electronics; ComponentLink7URL: https://datasheet.octopart.com:443/RC0603FR-07316KL-Yageo-datasheet-164759695.pdf?src-supplier=Future+Electronics; ComponentLink7Description: https://datasheet.octopart.com:443/RC0603FR-07316KL-Yageo-datasheet-164759695.pdf?src-supplier=Future+Electronics; ComponentLink8URL: https://datasheet.octopart.com:443/RC0603FR-07316KL-Yageo-datasheet-137700087.pdf?src-supplier=Future+Electronics; ComponentLink8Description: https://datasheet.octopart.com:443/RC0603FR-07316KL-Yageo-datasheet-137700087.pdf?src-supplier=Future+Electronics; ComponentLink9URL: https://datasheet.octopart.com:443/RC0603FR-07316KL-Yageo-datasheet-127823281.pdf?src-supplier=Future+Electronics; ComponentLink9Description: https://datasheet.octopart.com:443/RC0603FR-07316KL-Yageo-datasheet-127823281.pdf?src-supplier=Future+Electronics; ComponentLink10URL: https://datasheet.octopart.com:443/RC0603FR-07316KL-Yageo-datasheet-27584510.pdf?src-supplier=Future+Electronics; ComponentLink10Description: https://datasheet.octopart.com:443/RC0603FR-07316KL-Yageo-datasheet-27584510.pdf?src-supplier=Future+Electronics; ComponentLink11URL: https://datasheet.octopart.com:443/RC0603FR-07316KL-Yageo-datasheet-17842380.pdf?src-supplier=Future+Electronics; ComponentLink11Description: https://datasheet.octopart.com:443/RC0603FR-07316KL-Yageo-datasheet-17842380.pdf?src-supplier=Future+Electronics; ComponentLink12URL: https://datasheet.octopart.com:443/RC0603FR-07316KL-Yageo-datasheet-15599030.pdf?src-supplier=Future+Electronics; ComponentLink12Description: https://datasheet.octopart.com:443/RC0603FR-07316KL-Yageo-datasheet-15599030.pdf?src-supplier=Future+Electronics; ComponentLink13URL: https://datasheet.octopart.com:443/RC0603FR-07316KL-Yageo-datasheet-12596169.pdf?src-supplier=Future+Electronics; ComponentLink13Description: https://datasheet.octopart.com:443/RC0603FR-07316KL-Yageo-datasheet-12596169.pdf?src-supplier=Future+Electronics; ComponentLink14URL: https://datasheet.octopart.com:443/RC0603FR-07316KL-Yageo-datasheet-8328172.pdf?src-supplier=Future+Electronics; ComponentLink14Description: https://datasheet.octopart.com:443/RC0603FR-07316KL-Yageo-datasheet-8328172.pdf?src-supplier=Future+Electronics; ComponentLink15URL: https://datasheet.octopart.com/RC0603FR-07316KL-Yageo-datasheet-73766026.pdf; ComponentLink15Description: https://datasheet.octopart.com/RC0603FR-07316KL-Yageo-datasheet-73766026.pdf; ComponentLink16URL: https://datasheet.octopart.com:443/RC0603FR-07316KL-Yageo-datasheet-118562.pdf?src-supplier=DigiKey; ComponentLink16Description: https://datasheet.octopart.com:443/RC0603FR-07316KL-Yageo-datasheet-118562.pdf?src-supplier=DigiKey; ComponentLink17URL: http://sigma.octopart.com:80/conflict_mineral_statement/Yageo-company-3.pdf?src-supplier=Compliance+Statements; ComponentLink17Description: http://sigma.octopart.com:80/conflict_mineral_statement/Yageo-company-3.pdf?src-supplier=Compliance+Statements; ComponentLink18URL: http://sigma.octopart.com:80/rohs_statement/Yageo-company-2.pdf?src-supplier=Compliance+Statements; ComponentLink18Description: http://sigma.octopart.com:80/rohs_statement/Yageo-company-2.pdf?src-supplier=Compliance+Statements
R4 R5 R8 = RC0603FR-07100KL: RES 100K OHM 1% 1/10W 0603; Manufacturer: Yageo Group; Power Dissipation: 100mW; Value: 100kΩ; Temperature Coefficient: 100ppm/°C; Voltage Rating: 75V; Voltage Rating (DC): 50V; Supplier: DigiKey; Supplier Part Number: 311-100KHRCT-ND; Manufacturer Part Number: RC0603FR-07100KL; RoHS: Compliant; Category: Chip SMD Resistors; Stock: 5869617; Pricing: 1=0.1, 10=0.006, 25=0.0056, 5000=0.00204 (USD); Case/Package: 0603; Case Code (Imperial): 0603; Case Code (Metric): 0603; China RoHS: Non-Compliant; Composition: Thick Film; Country of Origin: Mainland China, Taiwan; Depth: 800µm; Export Control Classification Number (ECCN) Code: EAR99; Height: 450µm; Harmonized Tariff Schedule (HTS) Code: 8533.21.00.30; Introduction Date: 2004-09-22; Lead Free: Lead Free; Length: 1.6mm; Lifecycle Status: Production; Max Operating Temperature: 155°C; Military Standard: Not; Min Operating Temperature: -55°C; Mounting Technology: Surface Mount; Pins: 2; Number of Terminals: 2; Number of Terminations: 2; Packaging: Tape & Reel; Power Rating: 100mW; REACH SVHC: Yes; Schedule B: 8533210045, 8533210045|8533210045, 8533210045|8533210045|8533210045, 8533210045|8533210045|8533210045|8533210045; Termination: SMD/SMT; Tolerance: 1%; Width: 800µm; Working Voltage: 75V; ComponentLink1URL: https://datasheet.octopart.com:443/RC0603FR-07100KL-Yageo-datasheet-175887523.pdf?src-supplier=IHS; ComponentLink1Description: https://datasheet.octopart.com:443/RC0603FR-07100KL-Yageo-datasheet-175887523.pdf?src-supplier=IHS; ComponentLink2URL: https://datasheet.octopart.com:443/RC0603FR-07100KL-Yageo-datasheet-8328172.pdf?src-supplier=element14+APAC; ComponentLink2Description: https://datasheet.octopart.com:443/RC0603FR-07100KL-Yageo-datasheet-8328172.pdf?src-supplier=element14+APAC; ComponentLink3URL: https://datasheet.octopart.com:443/RC0603FR-07100KL-Yageo-datasheet-17842380.pdf?src-supplier=element14+APAC; ComponentLink3Description: https://datasheet.octopart.com:443/RC0603FR-07100KL-Yageo-datasheet-17842380.pdf?src-supplier=element14+APAC; ComponentLink4URL: https://datasheet.octopart.com:443/RC0603FR-07100KL-Yageo-datasheet-141265859.pdf?src-supplier=Upverter; ComponentLink4Description: https://datasheet.octopart.com:443/RC0603FR-07100KL-Yageo-datasheet-141265859.pdf?src-supplier=Upverter; ComponentLink5URL: https://datasheet.octopart.com:443/RC0603FR-07100KL-Yageo-datasheet-103092701.pdf?src-supplier=Upverter; ComponentLink5Description: https://datasheet.octopart.com:443/RC0603FR-07100KL-Yageo-datasheet-103092701.pdf?src-supplier=Upverter; ComponentLink6URL: https://sigma.octopart.com:443/138820526/technical_drawing/Yageo-RC0603FR-07100KL.pdf?src-supplier=Upverter; ComponentLink6Description: https://sigma.octopart.com:443/138820526/technical_drawing/Yageo-RC0603FR-07100KL.pdf?src-supplier=Upverter; ComponentLink7URL: https://datasheet.octopart.com:443/RC0603FR-07100KL-Yageo-datasheet-98239111.pdf?src-supplier=Upverter; ComponentLink7Description: https://datasheet.octopart.com:443/RC0603FR-07100KL-Yageo-datasheet-98239111.pdf?src-supplier=Upverter; ComponentLink8URL: https://datasheet.octopart.com:443/RC0603FR-07100KL-Yageo-datasheet-12596169.pdf?src-supplier=Newark; ComponentLink8Description: https://datasheet.octopart.com:443/RC0603FR-07100KL-Yageo-datasheet-12596169.pdf?src-supplier=Newark; ComponentLink9URL: https://datasheet.octopart.com:443/RC0603FR-07100KL-Yageo-datasheet-34211833.pdf?src-supplier=Newark; ComponentLink9Description: https://datasheet.octopart.com:443/RC0603FR-07100KL-Yageo-datasheet-34211833.pdf?src-supplier=Newark; ComponentLink10URL: https://datasheet.octopart.com:443/RC0603FR-07100KL-Yageo-datasheet-62067350.pdf?src-supplier=Farnell; ComponentLink10Description: https://datasheet.octopart.com:443/RC0603FR-07100KL-Yageo-datasheet-62067350.pdf?src-supplier=Farnell; ComponentLink11URL: https://datasheet.octopart.com:443/RC0603FR-07100KL-Yageo-datasheet-13691069.pdf?src-supplier=Farnell; ComponentLink11Description: https://datasheet.octopart.com:443/RC0603FR-07100KL-Yageo-datasheet-13691069.pdf?src-supplier=Farnell; ComponentLink12URL: https://datasheet.octopart.com:443/RC0603FR-07100KL-Yageo-Group-datasheet-176638170.pdf?src-supplier=Future+Electronics; ComponentLink12Description: https://datasheet.octopart.com:443/RC0603FR-07100KL-Yageo-Group-datasheet-176638170.pdf?src-supplier=Future+Electronics; ComponentLink13URL: https://datasheet.octopart.com:443/RC0603FR-07100KL-Yageo-datasheet-164759695.pdf?src-supplier=Future+Electronics; ComponentLink13Description: https://datasheet.octopart.com:443/RC0603FR-07100KL-Yageo-datasheet-164759695.pdf?src-supplier=Future+Electronics; ComponentLink14URL: https://datasheet.octopart.com:443/RC0603FR-07100KL-Yageo-datasheet-137700087.pdf?src-supplier=Future+Electronics; ComponentLink14Description: https://datasheet.octopart.com:443/RC0603FR-07100KL-Yageo-datasheet-137700087.pdf?src-supplier=Future+Electronics; ComponentLink15URL: https://datasheet.octopart.com:443/RC0603FR-07100KL-Yageo-datasheet-27584510.pdf?src-supplier=Future+Electronics; ComponentLink15Description: https://datasheet.octopart.com:443/RC0603FR-07100KL-Yageo-datasheet-27584510.pdf?src-supplier=Future+Electronics; ComponentLink16URL: https://datasheet.octopart.com:443/RC0603FR-07100KL-Yageo-datasheet-15599030.pdf?src-supplier=Future+Electronics; ComponentLink16Description: https://datasheet.octopart.com:443/RC0603FR-07100KL-Yageo-datasheet-15599030.pdf?src-supplier=Future+Electronics; ComponentLink17URL: https://datasheet.octopart.com:443/RC0603FR-07100KL-Yageo-datasheet-8324193.pdf?src-supplier=Future+Electronics; ComponentLink17Description: https://datasheet.octopart.com:443/RC0603FR-07100KL-Yageo-datasheet-8324193.pdf?src-supplier=Future+Electronics; ComponentLink18URL: https://datasheet.octopart.com:443/RC0603FR-07100KL-Yageo-datasheet-79472498.pdf?src-supplier=Megastar; ComponentLink18Description: https://datasheet.octopart.com:443/RC0603FR-07100KL-Yageo-datasheet-79472498.pdf?src-supplier=Megastar; ComponentLink19URL: https://datasheet.octopart.com/RC0603FR-07100KL-Yageo-datasheet-73766026.pdf; ComponentLink19Description: https://datasheet.octopart.com/RC0603FR-07100KL-Yageo-datasheet-73766026.pdf; ComponentLink20URL: https://datasheet.octopart.com:443/RC0603FR-07100KL-Yageo-datasheet-30459151.pdf?src-supplier=Seeed+Studio; ComponentLink20Description: https://datasheet.octopart.com:443/RC0603FR-07100KL-Yageo-datasheet-30459151.pdf?src-supplier=Seeed+Studio; ComponentLink21URL: https://datasheet.octopart.com:443/RC0603FR-07100KL-Yageo-datasheet-118562.pdf?src-supplier=DigiKey; ComponentLink21Description: https://datasheet.octopart.com:443/RC0603FR-07100KL-Yageo-datasheet-118562.pdf?src-supplier=DigiKey; ComponentLink22URL: https://datasheet.octopart.com:443/RC0603FR-07100KL-Yageo-datasheet-503470.pdf?src-supplier=element14; ComponentLink22Description: https://datasheet.octopart.com:443/RC0603FR-07100KL-Yageo-datasheet-503470.pdf?src-supplier=element14; ComponentLink23URL: http://sigma.octopart.com:80/conflict_mineral_statement/Yageo-company-3.pdf?src-supplier=Compliance+Statements; ComponentLink23Description: http://sigma.octopart.com:80/conflict_mineral_statement/Yageo-company-3.pdf?src-supplier=Compliance+Statements; ComponentLink24URL: http://sigma.octopart.com:80/rohs_statement/Yageo-company-2.pdf?src-supplier=Compliance+Statements; ComponentLink24Description: http://sigma.octopart.com:80/rohs_statement/Yageo-company-2.pdf?src-supplier=Compliance+Statements
R6 R7 = RC0402FR-075K1L: RES 5.1K OHM 1% 1/16W 0402; Manufacturer: Yageo; Additional Feature: LASER TRIMMABLE; Power: 62.5mW; Rated Temperature: 70°C; Value: 5.1kR; Working Voltage: 50V; Temperature Coefficient (ppm/Cel): 100; Package Height: 0.35mm; Package Length: 1mm; Package Width: 0.5mm; Supplier: Digikey; Supplier Part Number: 311-5.10KLRCT-ND; Manufacturer Part Number: RC0402FR-075K1L; RoHS: Yes; Category: Chip SMD Resistors; Stock: 371525; Pricing: 1=0.1, 10=0.008, 100=0.0061, 1000=0.0051, 2500=0.00408 (USD); Mounting Technology: Surface Mount; Pins: 2; Package Shape: Rectangular; Case/Package: 0402; Terminal Finish: Nickel; Min Operating Temperature: -55°C; Max Operating Temperature: 155°C; Tolerance: 1%; JESD-609 Code: e3; Resistor Type: FIXED RESISTOR; Construction: Chip; Packaging: Tape and Reel; Technology: METAL GLAZE/THICK FILM; Termination: Wraparound; Reach SVHC Compliant: Yes; RoHS Compliant: Yes; ComponentLink1URL: https://datasheet.ciiva.com:443/pdfs/VipMasterIC/IC/YAGO/YAGO-S-A0008145938/YAGO-S-A0008145938-1.pdf?src-supplier=IHS+Markit; ComponentLink1Description: https://datasheet.ciiva.com:443/pdfs/VipMasterIC/IC/YAGO/YAGO-S-A0008145938/YAGO-S-A0008145938-1.pdf?src-supplier=IHS+Markit; ComponentLink2URL: https://datasheet.ciiva.com/2453/pyu-r-int-thick-7-2453400.pdf?src-supplier=Digikey; ComponentLink2Description: https://datasheet.ciiva.com/2453/pyu-r-int-thick-7-2453400.pdf?src-supplier=Digikey; ComponentLink3URL: https://datasheet.ciiva.com/2453/pyu-r-int-thick-7-2453401.pdf?src-supplier=Digikey; ComponentLink3Description: https://datasheet.ciiva.com/2453/pyu-r-int-thick-7-2453401.pdf?src-supplier=Digikey; ComponentLink4URL: https://datasheet.ciiva.com/2453/pyu-r-int-thick-7-2453402.pdf?src-supplier=Digikey; ComponentLink4Description: https://datasheet.ciiva.com/2453/pyu-r-int-thick-7-2453402.pdf?src-supplier=Digikey; ComponentLink5URL: https://datasheet.ciiva.com/46394/1018594-46394936.pdf?src-supplier=Element14; ComponentLink5Description: https://datasheet.ciiva.com/46394/1018594-46394936.pdf?src-supplier=Element14; ComponentLink6URL: https://datasheet.ciiva.com/12558/pyu-rc0402-51-rohs-l-6-r-8721-12558460.pdf?src-supplier=Mouser; ComponentLink6Description: https://datasheet.ciiva.com/12558/pyu-rc0402-51-rohs-l-6-r-8721-12558460.pdf?src-supplier=Mouser; ComponentLink7URL: https://datasheet.ciiva.com/16744/pyu-rc0402-51-rohs-l-6-r-16744283.pdf?src-supplier=Future+Electronics; ComponentLink7Description: https://datasheet.ciiva.com/16744/pyu-rc0402-51-rohs-l-6-r-16744283.pdf?src-supplier=Future+Electronics; ComponentLink8URL: https://datasheet.ciiva.com/15189/getdatasheetpartid-323636-15189493.pdf?src-supplier=Verical; ComponentLink8Description: https://datasheet.ciiva.com/15189/getdatasheetpartid-323636-15189493.pdf?src-supplier=Verical
R9-R11 R15 R16 R18 R19 = AC0402FR-0710KL: RES SMD 10K OHM 1% 1/16W 0402; Manufacturer: Yageo; Additional Feature: LASER TRIMMABLE; Power: 62.5mW; Rated Temperature: 70°C; Value: 10kR; Working Voltage: 50V; Temperature Coefficient (ppm/Cel): 100; Package Height: 0.32mm; Package Length: 1mm; Package Width: 0.5mm; Reference Standard: AEC-Q200; Supplier: Digikey; Supplier Part Number: YAG3436CT-ND; Manufacturer Part Number: AC0402FR-0710KL; RoHS: Yes; Category: Chip SMD Resistors; Stock: 519754; Pricing: 1=0.1, 10=0.009, 100=0.0082, 1000=0.00612, 2500=0.0051, 10000=0.00204 (USD); Mounting Technology: Surface Mount; Pins: 2; Package Shape: Rectangular; Case/Package: 0402; Terminal Finish: Nickel; Min Operating Temperature: -55°C; Max Operating Temperature: 155°C; Tolerance: 1%; JESD-609 Code: e3; Resistor Type: FIXED RESISTOR; Construction: Chip; Packaging: Tape and Reel; Technology: METAL GLAZE/THICK FILM; Termination: Wraparound; Reach SVHC Compliant: Yes; RoHS Compliant: Yes; ComponentLink1URL: https://datasheet.ciiva.com:443/pdfs/VipMasterIC/IC/YAGO/YAGO-S-A0003597364/YAGO-S-A0003597364-1.pdf?src-supplier=IHS+Markit; ComponentLink1Description: https://datasheet.ciiva.com:443/pdfs/VipMasterIC/IC/YAGO/YAGO-S-A0003597364/YAGO-S-A0003597364-1.pdf?src-supplier=IHS+Markit; ComponentLink2URL: https://datasheet.ciiva.com/12656/pyu-ac-51-rohs-l-2-12656634.pdf?src-supplier=Mouser; ComponentLink2Description: https://datasheet.ciiva.com/12656/pyu-ac-51-rohs-l-2-12656634.pdf?src-supplier=Mouser